# Altium schematic sheet PlatypusDAQ.SchDoc
size C
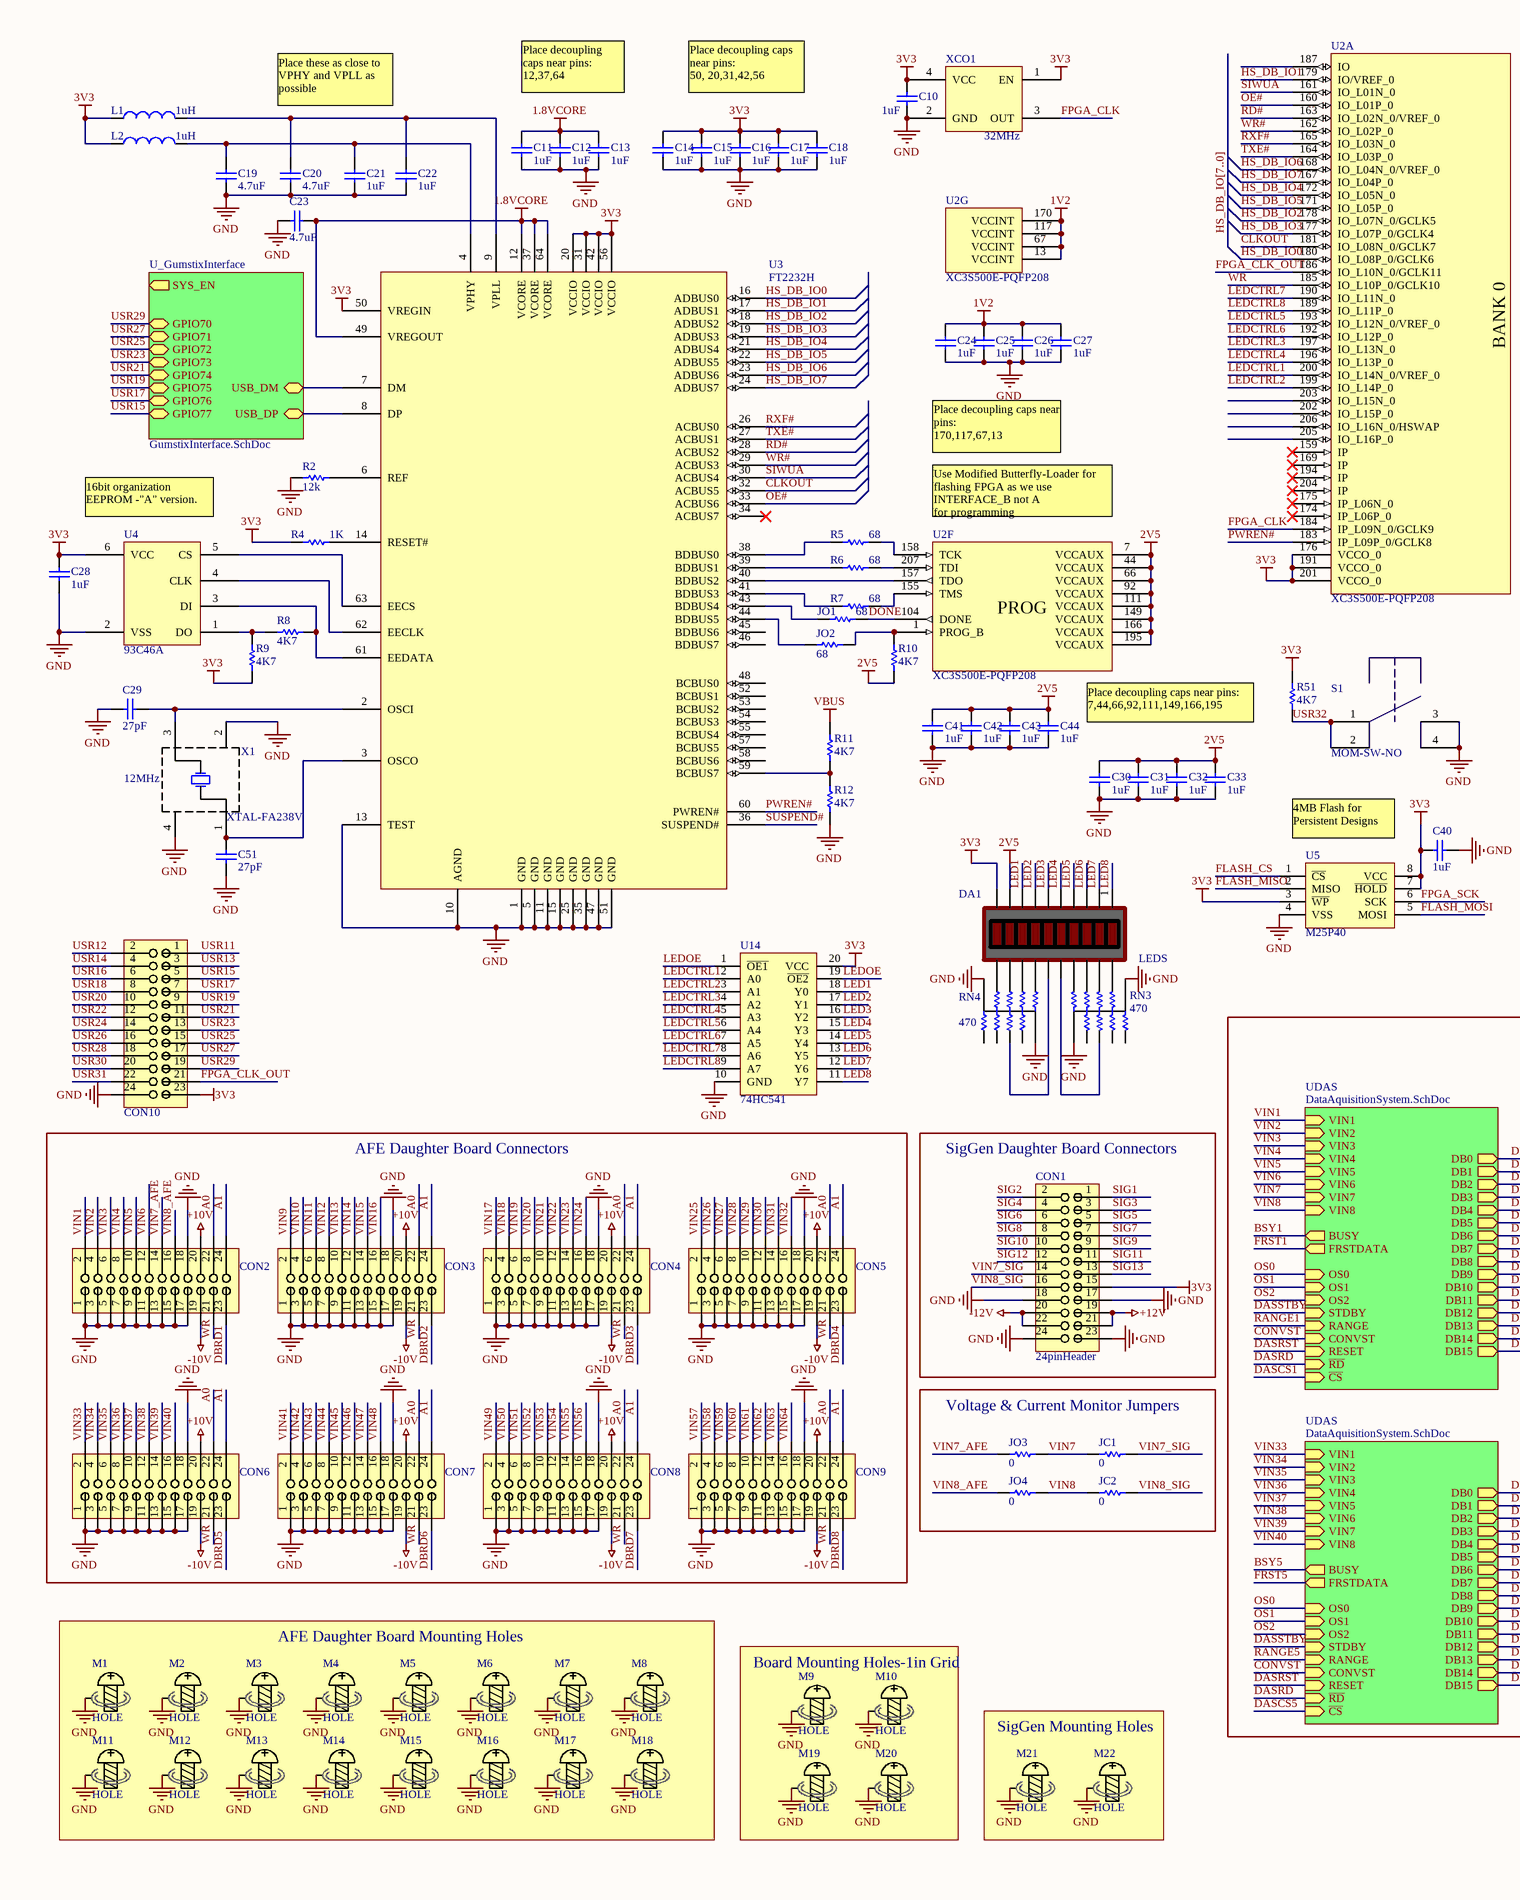
[diagram p0: PlatypusDAQ.SchDoc, left]
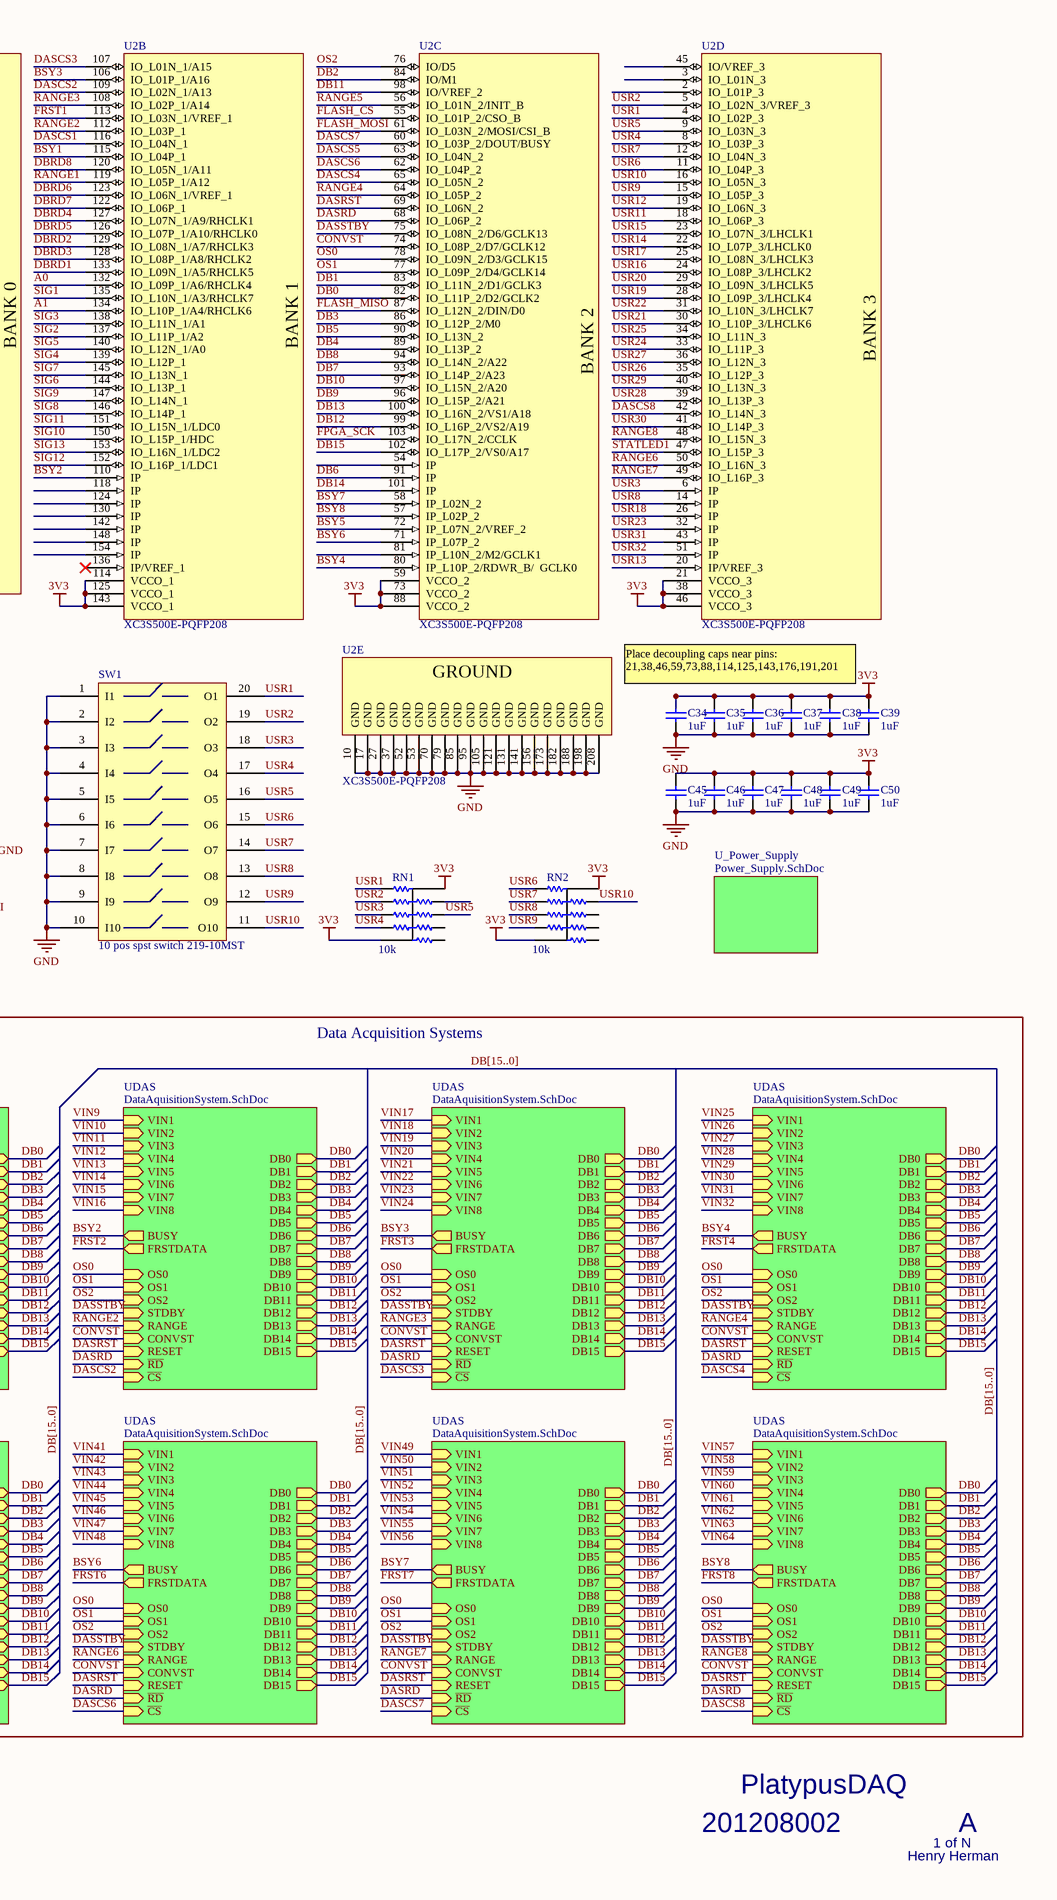
[diagram p1: PlatypusDAQ.SchDoc, right]

## Parts
C10  Label: 1uF  [SM/C_0603]  (hidden comment: CAP)
C11  Label: 1uF  [SM/C_0603]  (hidden comment: CAP)
C12  Label: 1uF  [SM/C_0603]  (hidden comment: CAP)
C13  Label: 1uF  [SM/C_0603]  (hidden comment: CAP)
C14  Label: 1uF  [SM/C_0603]  (hidden comment: CAP)
C15  Label: 1uF  [SM/C_0603]  (hidden comment: CAP)
C16  Label: 1uF  [SM/C_0603]  (hidden comment: CAP)
C17  Label: 1uF  [SM/C_0603]  (hidden comment: CAP)
C18  Label: 1uF  [SM/C_0603]  (hidden comment: CAP)
C19  Label: 4.7uF  [SM/C_0603]  (hidden comment: CAP)
C20  Label: 4.7uF  [SM/C_0603]  (hidden comment: CAP)
C21  Label: 1uF  [SM/C_0603]  (hidden comment: CAP)
C22  Label: 1uF  [SM/C_0603]  (hidden comment: CAP)
C23  Label: 4.7uF  [SM/C_0603]  (hidden comment: CAP)
C24  Label: 1uF  [SM/C_0603]  (hidden comment: CAP)
C25  Label: 1uF  [SM/C_0603]  (hidden comment: CAP)
C26  Label: 1uF  [SM/C_0603]  (hidden comment: CAP)
C27  Label: 1uF  [SM/C_0603]  (hidden comment: CAP)
C28  Label: 1uF  [SM/C_0603]  (hidden comment: CAP)
C29  Label: 27pF  [SM/C_0603]  (hidden comment: CAP)
C30  Label: 1uF  [SM/C_0603]  (hidden comment: CAP)
C31  Label: 1uF  [SM/C_0603]  (hidden comment: CAP)
C32  Label: 1uF  [SM/C_0603]  (hidden comment: CAP)
C33  Label: 1uF  [SM/C_0603]  (hidden comment: CAP)
C34  Label: 1uF  [SM/C_0603]  (hidden comment: CAP)
C35  Label: 1uF  [SM/C_0603]  (hidden comment: CAP)
C36  Label: 1uF  [SM/C_0603]  (hidden comment: CAP)
C37  Label: 1uF  [SM/C_0603]  (hidden comment: CAP)
C38  Label: 1uF  [SM/C_0603]  (hidden comment: CAP)
C39  Label: 1uF  [SM/C_0603]  (hidden comment: CAP)
C40  Label: 1uF  [SM/C_0603]  (hidden comment: CAP)
C41  Label: 1uF  [SM/C_0603]  (hidden comment: CAP)
C42  Label: 1uF  [SM/C_0603]  (hidden comment: CAP)
C43  Label: 1uF  [SM/C_0603]  (hidden comment: CAP)
C44  Label: 1uF  [SM/C_0603]  (hidden comment: CAP)
C45  Label: 1uF  [SM/C_0603]  (hidden comment: CAP)
C46  Label: 1uF  [SM/C_0603]  (hidden comment: CAP)
C47  Label: 1uF  [SM/C_0603]  (hidden comment: CAP)
C48  Label: 1uF  [SM/C_0603]  (hidden comment: CAP)
C49  Label: 1uF  [SM/C_0603]  (hidden comment: CAP)
C50  Label: 1uF  [SM/C_0603]  (hidden comment: CAP)
C51  Label: 27pF  [SM/C_0603]  (hidden comment: CAP)
CON1  24pinHeader  [CONN-RECEPT-24PIN]
CON2  24pinHeader  [CONN-RECEPT-24PIN]  (value not drawn)
CON3  24pinHeader  [CONN-RECEPT-24PIN]  (value not drawn)
CON4  24pinHeader  [CONN-RECEPT-24PIN]  (value not drawn)
CON5  24pinHeader  [CONN-RECEPT-24PIN]  (value not drawn)
CON6  24pinHeader  [CONN-RECEPT-24PIN]  (value not drawn)
CON7  24pinHeader  [CONN-RECEPT-24PIN]  (value not drawn)
CON8  24pinHeader  [CONN-RECEPT-24PIN]  (value not drawn)
CON9  24pinHeader  [CONN-RECEPT-24PIN]  (value not drawn)
CON10  24pinHeader  [CONN-RECEPT-24PIN]  (value not drawn)
DA1  LEDS  [LEDBARGRAPH]
JC1  value 0  [SM/R_0603]  (hidden comment: Res)
JC2  value 0  [SM/R_0603]  (hidden comment: Res)
JO1  value 68  [SM/R_0603]  (hidden comment: Res)
JO2  value 68  [SM/R_0603]  (hidden comment: Res)
JO3  value 0  [SM/R_0603]  (hidden comment: Res)
JO4  value 0  [SM/R_0603]  (hidden comment: Res)
L1  value 1uH  [SM/L_0805]  (hidden comment: Inductor)
L2  value 1uH  [SM/L_0805]  (hidden comment: Inductor)
M1  HOLE  [MOUNTING_HOLE-125mil]
M2  HOLE  [MOUNTING_HOLE-125mil]
M3  HOLE  [MOUNTING_HOLE-125mil]
M4  HOLE  [MOUNTING_HOLE-125mil]
M5  HOLE  [MOUNTING_HOLE-125mil]
M6  HOLE  [MOUNTING_HOLE-125mil]
M7  HOLE  [MOUNTING_HOLE-125mil]
M8  HOLE  [MOUNTING_HOLE-125mil]
M9  HOLE  [MOUNTING_HOLE-125mil]
M10  HOLE  [MOUNTING_HOLE-125mil]
M11  HOLE  [MOUNTING_HOLE-125mil]
M12  HOLE  [MOUNTING_HOLE-125mil]
M13  HOLE  [MOUNTING_HOLE-125mil]
M14  HOLE  [MOUNTING_HOLE-125mil]
M15  HOLE  [MOUNTING_HOLE-125mil]
M16  HOLE  [MOUNTING_HOLE-125mil]
M17  HOLE  [MOUNTING_HOLE-125mil]
M18  HOLE  [MOUNTING_HOLE-125mil]
M19  HOLE  [MOUNTING_HOLE-125mil]
M20  HOLE  [MOUNTING_HOLE-125mil]
M21  HOLE  [MOUNTING_HOLE-125mil]
M22  HOLE  [MOUNTING_HOLE-125mil]
R2  value 12k  [SM/R_0603]  (hidden comment: Res)
R4  value 1K  [SM/R_0603]  (hidden comment: Res)
R5  value 68  [SM/R_0603]  (hidden comment: Res)
R6  value 68  [SM/R_0603]  (hidden comment: Res)
R7  value 68  [SM/R_0603]  (hidden comment: Res)
R8  value 4K7  [SM/R_0603]  (hidden comment: Res)
R9  value 4K7  [SM/R_0603]  (hidden comment: Res)
R10  value 4K7  [SM/R_0603]  (hidden comment: Res)
R11  value 4K7  [SM/R_0603]  (hidden comment: Res)
R12  value 4K7  [SM/R_0603]  (hidden comment: Res)
R51  value 4K7  [SM/R_0603]  (hidden comment: Res)
RN1  value 10k  [RN-5x603]  (hidden comment: RN-8X)
RN2  value 10k  [RN-5x603]  (hidden comment: RN-8X)
RN3  value 470  [RN-5x603]  (hidden comment: RN-8X)
RN4  value 470  [RN-5x603]  (hidden comment: RN-8X)
S1  MOM-SW-NO  [MOM-SW]
SW1  10 pos spst switch 219-10MST  [SW-10pos-SPST]
U2  XC3S500E-PQFP208  [PQFP-208PIN-PQ208-PQG208]  (parts A,B,C,D,E,F,G of 7)
U3  FT2232H  [LQFP-64PIN-FTDI-FT2232H]
U4  93C46A  [SOT23-93C46-EEPROM-Microchip]
U5  M25P40  [SOIC-8pin-micron-M25P40-Flash]
U14  74HC541  [TSSOP-20PIN-74HC541]
X1  XTAL-FA238V  value 12MHz  [XTAL 12MHz SMD]
XCO1  value 32MHz  [CB3&CB3LV-XCO]  (hidden comment: OSC)

## Blocks framed on the sheet
AFE Daughter Board Connectors: CON2-CON9
SigGen Daughter Board Connectors: CON1
Voltage & Current Monitor Jumpers: JC1 JC2 JO3 JO4
AFE Daughter Board Mounting Holes: M1-M8 M11-M18
Board Mounting Holes-1in Grid: M9 M10 M19 M20
SigGen Mounting Holes: M21 M22

## Sub-sheets
U_GumstixInterface = GumstixInterface.SchDoc: SYS_EN (out), USB_DM (bidir), USB_DP (bidir), GPIO70 (bidir), GPIO71 (bidir), GPIO72 (bidir), GPIO73 (bidir), GPIO74 (bidir), GPIO75 (bidir), GPIO76 (bidir), GPIO77 (bidir)
U_Power_Supply = Power_Supply.SchDoc: no entries
UDAS = DataAquisitionSystem.SchDoc: VIN1 (in), VIN2 (in), VIN3 (in), VIN4 (in), VIN5 (in), VIN6 (in), VIN7 (in), VIN8 (in), OS0 (in), OS1 (in), OS2 (in), STDBY (in), RANGE (in), CONVST (in), RESET (in), ~{RD} (in), ~{CS} (in), BUSY (out), FRSTDATA (out), DB0 (out), DB1 (out), DB2 (out), DB3 (out), DB4 (out), DB5 (out), DB6 (out), DB7 (out), DB8 (out), DB9 (out), DB10 (out), DB11 (out), DB12 (out), DB13 (out), DB14 (out), DB15 (out)
UDAS = DataAquisitionSystem.SchDoc: VIN1 (in), VIN2 (in), VIN3 (in), VIN4 (in), VIN5 (in), VIN6 (in), VIN7 (in), VIN8 (in), OS0 (in), OS1 (in), OS2 (in), STDBY (in), RANGE (in), CONVST (in), RESET (in), ~{RD} (in), ~{CS} (in), BUSY (out), FRSTDATA (out), DB0 (out), DB1 (out), DB2 (out), DB3 (out), DB4 (out), DB5 (out), DB6 (out), DB7 (out), DB8 (out), DB9 (out), DB10 (out), DB11 (out), DB12 (out), DB13 (out), DB14 (out), DB15 (out)
UDAS = DataAquisitionSystem.SchDoc: VIN1 (in), VIN2 (in), VIN3 (in), VIN4 (in), VIN5 (in), VIN6 (in), VIN7 (in), VIN8 (in), OS0 (in), OS1 (in), OS2 (in), STDBY (in), RANGE (in), CONVST (in), RESET (in), ~{RD} (in), ~{CS} (in), BUSY (out), FRSTDATA (out), DB0 (out), DB1 (out), DB2 (out), DB3 (out), DB4 (out), DB5 (out), DB6 (out), DB7 (out), DB8 (out), DB9 (out), DB10 (out), DB11 (out), DB12 (out), DB13 (out), DB14 (out), DB15 (out)
UDAS = DataAquisitionSystem.SchDoc: VIN1 (in), VIN2 (in), VIN3 (in), VIN4 (in), VIN5 (in), VIN6 (in), VIN7 (in), VIN8 (in), OS0 (in), OS1 (in), OS2 (in), STDBY (in), RANGE (in), CONVST (in), RESET (in), ~{RD} (in), ~{CS} (in), BUSY (out), FRSTDATA (out), DB0 (out), DB1 (out), DB2 (out), DB3 (out), DB4 (out), DB5 (out), DB6 (out), DB7 (out), DB8 (out), DB9 (out), DB10 (out), DB11 (out), DB12 (out), DB13 (out), DB14 (out), DB15 (out)
UDAS = DataAquisitionSystem.SchDoc: VIN1 (in), VIN2 (in), VIN3 (in), VIN4 (in), VIN5 (in), VIN6 (in), VIN7 (in), VIN8 (in), OS0 (in), OS1 (in), OS2 (in), STDBY (in), RANGE (in), CONVST (in), RESET (in), ~{RD} (in), ~{CS} (in), BUSY (out), FRSTDATA (out), DB0 (out), DB1 (out), DB2 (out), DB3 (out), DB4 (out), DB5 (out), DB6 (out), DB7 (out), DB8 (out), DB9 (out), DB10 (out), DB11 (out), DB12 (out), DB13 (out), DB14 (out), DB15 (out)
UDAS = DataAquisitionSystem.SchDoc: VIN1 (in), VIN2 (in), VIN3 (in), VIN4 (in), VIN5 (in), VIN6 (in), VIN7 (in), VIN8 (in), OS0 (in), OS1 (in), OS2 (in), STDBY (in), RANGE (in), CONVST (in), RESET (in), ~{RD} (in), ~{CS} (in), BUSY (out), FRSTDATA (out), DB0 (out), DB1 (out), DB2 (out), DB3 (out), DB4 (out), DB5 (out), DB6 (out), DB7 (out), DB8 (out), DB9 (out), DB10 (out), DB11 (out), DB12 (out), DB13 (out), DB14 (out), DB15 (out)
UDAS = DataAquisitionSystem.SchDoc: VIN1 (in), VIN2 (in), VIN3 (in), VIN4 (in), VIN5 (in), VIN6 (in), VIN7 (in), VIN8 (in), OS0 (in), OS1 (in), OS2 (in), STDBY (in), RANGE (in), CONVST (in), RESET (in), ~{RD} (in), ~{CS} (in), BUSY (out), FRSTDATA (out), DB0 (out), DB1 (out), DB2 (out), DB3 (out), DB4 (out), DB5 (out), DB6 (out), DB7 (out), DB8 (out), DB9 (out), DB10 (out), DB11 (out), DB12 (out), DB13 (out), DB14 (out), DB15 (out)
UDAS = DataAquisitionSystem.SchDoc: VIN1 (in), VIN2 (in), VIN3 (in), VIN4 (in), VIN5 (in), VIN6 (in), VIN7 (in), VIN8 (in), OS0 (in), OS1 (in), OS2 (in), STDBY (in), RANGE (in), CONVST (in), RESET (in), ~{RD} (in), ~{CS} (in), BUSY (out), FRSTDATA (out), DB0 (out), DB1 (out), DB2 (out), DB3 (out), DB4 (out), DB5 (out), DB6 (out), DB7 (out), DB8 (out), DB9 (out), DB10 (out), DB11 (out), DB12 (out), DB13 (out), DB14 (out), DB15 (out)

## Nets
1.8VCORE: C11.2 C12.2 C13.2 C23.2 U3.12(VCORE) U3.37(VCORE) U3.49(VREGOUT) U3.64(VCORE)
1V2: C24.2 C25.2 C26.2 C27.2 U2.13(VCCINT) U2.67(VCCINT) U2.117(VCCINT) U2.170(VCCINT)
2V5: C30.2 C31.2 C32.2 C33.2 C41.2 C42.2 C43.2 C44.2 DA1.9(A) R10.1 U2.7(VCCAUX) U2.44(VCCAUX) U2.66(VCCAUX) U2.92(VCCAUX) U2.111(VCCAUX) U2.149(VCCAUX) U2.166(VCCAUX) U2.195(VCCAUX)
3V3: C10.2 C14.2 C15.2 C16.2 C17.2 C18.2 C28.2 C34.2 C35.2 C36.2 C37.2 C38.2 C39.2 C40.2 C45.2 C46.2 C47.2 C48.2 C49.2 C50.2 CON1.15 CON10.23 DA1.10(A) L1.1 L2.1 R4.1 R9.1 R51.1 RN1.COM RN2.COM U2.21(VCCO_3) U2.38(VCCO_3) U2.46(VCCO_3) U2.59(VCCO_2) U2.73(VCCO_2) U2.88(VCCO_2) U2.114(VCCO_1) U2.125(VCCO_1) U2.143(VCCO_1) U2.176(VCCO_0) U2.191(VCCO_0) U2.201(VCCO_0) U3.20(VCCIO) U3.31(VCCIO) U3.42(VCCIO) U3.50(VREGIN) U3.56(VCCIO) U4.6(VCC) U5.3(~{WP}) U5.7(~{HOLD}) U5.8(VCC) U14.20(VCC) XCO1.1(EN) XCO1.4(VCC)
+10V: CON2.20 CON3.20 CON4.20 CON5.20 CON6.20 CON7.20 CON8.20 CON9.20
+12V: CON1.19 CON1.21
-10V: CON2.19 CON3.19 CON4.19 CON5.19 CON6.19 CON7.19 CON8.19 CON9.19
-12V: CON1.20 CON1.22
GND: C10.1 C11.1 C12.1 C13.1 C14.1 C15.1 C16.1 C17.1 C18.1 C19.1 C20.1 C21.1 C22.1 C23.1 C24.1 C25.1 C26.1 C27.1 C28.1 C29.2 C30.1 C31.1 C32.1 C33.1 C34.1 C35.1 C36.1 C37.1 C38.1 C39.1 C40.1 C41.1 C42.1 C43.1 C44.1 C45.1 C46.1 C47.1 C48.1 C49.1 C50.1 C51.1 CON1.17 CON1.18 CON1.23 CON1.24 CON2.1 CON2.3 CON2.5 CON2.7 CON2.9 CON2.11 CON2.13 CON2.15 CON2.17 CON2.18 CON3.1 CON3.3 CON3.5 CON3.7 CON3.9 CON3.11 CON3.13 CON3.15 CON3.17 CON3.18 CON4.1 CON4.3 CON4.5 CON4.7 CON4.9 CON4.11 CON4.13 CON4.15 CON4.17 CON4.18 CON5.1 CON5.3 CON5.5 CON5.7 CON5.9 CON5.11 CON5.13 CON5.15 CON5.17 CON5.18 CON6.1 CON6.3 CON6.5 CON6.7 CON6.9 CON6.11 CON6.13 CON6.15 CON6.17 CON6.18 CON7.1 CON7.3 CON7.5 CON7.7 CON7.9 CON7.11 CON7.13 CON7.15 CON7.17 CON7.18 CON8.1 CON8.3 CON8.5 CON8.7 CON8.9 CON8.11 CON8.13 CON8.15 CON8.17 CON8.18 CON9.1 CON9.3 CON9.5 CON9.7 CON9.9 CON9.11 CON9.13 CON9.15 CON9.17 CON9.18 CON10.24 M1.0(PAD) M2.0(PAD) M3.0(PAD) M4.0(PAD) M5.0(PAD) M6.0(PAD) M7.0(PAD) M8.0(PAD) M9.0(PAD) M10.0(PAD) M11.0(PAD) M12.0(PAD) M13.0(PAD) M14.0(PAD) M15.0(PAD) M16.0(PAD) M17.0(PAD) M18.0(PAD) M19.0(PAD) M20.0(PAD) M21.0(PAD) M22.0(PAD) R2.2 R12.2 RN3.COM RN4.COM S1.3 S1.4 SW1.1(I1) SW1.2(I2) SW1.3(I3) SW1.4(I4) SW1.5(I5) SW1.6(I6) SW1.7(I7) SW1.8(I8) SW1.9(I9) SW1.10(I10) U2.10(GND) U2.17(GND) U2.27(GND) U2.37(GND) U2.52(GND) U2.53(GND) U2.70(GND) U2.79(GND) U2.85(GND) U2.95(GND) U2.105(GND) U2.121(GND) U2.131(GND) U2.141(GND) U2.156(GND) U2.173(GND) U2.182(GND) U2.188(GND) U2.198(GND) U2.208(GND) U3.1(GND) U3.5(GND) U3.10(AGND) U3.11(GND) U3.13(TEST) U3.15(GND) U3.25(GND) U3.35(GND) U3.47(GND) U3.51(GND) U4.2(VSS) U5.4(VSS) U14.10(GND) X1.2 X1.4 XCO1.2(GND)
VBUS: R11.1
A0: CON2.22 CON3.22 CON4.22 CON5.22 CON6.22 CON7.22 CON8.22 CON9.22 U2.132(IO_L09P_1/A6/RHCLK4)
A1: CON2.24 CON3.24 CON4.24 CON5.24 CON6.24 CON7.24 CON8.24 CON9.24 U2.134(IO_L10P_1/A4/RHCLK6)
BSY1: U2.115(IO_L04P_1) ; sheet UDAS/BUSY
BSY2: U2.110(IP) ; sheet UDAS/BUSY
BSY3: U2.106(IO_L01P_1/A16) ; sheet UDAS/BUSY
BSY4: U2.80(IP_L10P_2/RDWR_B/__GCLK0) ; sheet UDAS/BUSY
BSY5: U2.72(IP_L07N_2/VREF_2) ; sheet UDAS/BUSY
BSY6: U2.71(IP_L07P_2) ; sheet UDAS/BUSY
BSY7: U2.58(IP_L02N_2) ; sheet UDAS/BUSY
BSY8: U2.57(IP_L02P_2) ; sheet UDAS/BUSY
CLKOUT: U2.181(IO_L08N_0/GCLK7) U3.32(ACBUS5)
CONVST: U2.74(IO_L08P_2/D7/GCLK12) ; sheet UDAS/CONVST, sheet UDAS/CONVST, sheet UDAS/CONVST, sheet UDAS/CONVST, sheet UDAS/CONVST, sheet UDAS/CONVST, sheet UDAS/CONVST, sheet UDAS/CONVST
DASCS1: U2.116(IO_L04N_1) ; sheet UDAS/~{CS}
DASCS2: U2.109(IO_L02N_1/A13) ; sheet UDAS/~{CS}
DASCS3: U2.107(IO_L01N_1/A15) ; sheet UDAS/~{CS}
DASCS4: U2.65(IO_L05N_2) ; sheet UDAS/~{CS}
DASCS5: U2.63(IO_L04N_2) ; sheet UDAS/~{CS}
DASCS6: U2.62(IO_L04P_2) ; sheet UDAS/~{CS}
DASCS7: U2.60(IO_L03P_2/DOUT/BUSY) ; sheet UDAS/~{CS}
DASCS8: U2.42(IO_L14N_3) ; sheet UDAS/~{CS}
DASRD: U2.68(IO_L06P_2) ; sheet UDAS/~{RD}, sheet UDAS/~{RD}, sheet UDAS/~{RD}, sheet UDAS/~{RD}, sheet UDAS/~{RD}, sheet UDAS/~{RD}, sheet UDAS/~{RD}, sheet UDAS/~{RD}
DASRST: U2.69(IO_L06N_2) ; sheet UDAS/RESET, sheet UDAS/RESET, sheet UDAS/RESET, sheet UDAS/RESET, sheet UDAS/RESET, sheet UDAS/RESET, sheet UDAS/RESET, sheet UDAS/RESET
DASSTBY: U2.75(IO_L08N_2/D6/GCLK13) ; sheet UDAS/STDBY, sheet UDAS/STDBY, sheet UDAS/STDBY, sheet UDAS/STDBY, sheet UDAS/STDBY, sheet UDAS/STDBY, sheet UDAS/STDBY, sheet UDAS/STDBY
DB0: U2.82(IO_L11P_2/D2/GCLK2) ; sheet UDAS/DB0, sheet UDAS/DB0, sheet UDAS/DB0, sheet UDAS/DB0, sheet UDAS/DB0, sheet UDAS/DB0, sheet UDAS/DB0, sheet UDAS/DB0
DB1: U2.83(IO_L11N_2/D1/GCLK3) ; sheet UDAS/DB1, sheet UDAS/DB1, sheet UDAS/DB1, sheet UDAS/DB1, sheet UDAS/DB1, sheet UDAS/DB1, sheet UDAS/DB1, sheet UDAS/DB1
DB2: U2.84(IO/M1) ; sheet UDAS/DB2, sheet UDAS/DB2, sheet UDAS/DB2, sheet UDAS/DB2, sheet UDAS/DB2, sheet UDAS/DB2, sheet UDAS/DB2, sheet UDAS/DB2
DB3: U2.86(IO_L12P_2/M0) ; sheet UDAS/DB3, sheet UDAS/DB3, sheet UDAS/DB3, sheet UDAS/DB3, sheet UDAS/DB3, sheet UDAS/DB3, sheet UDAS/DB3, sheet UDAS/DB3
DB4: U2.89(IO_L13P_2) ; sheet UDAS/DB4, sheet UDAS/DB4, sheet UDAS/DB4, sheet UDAS/DB4, sheet UDAS/DB4, sheet UDAS/DB4, sheet UDAS/DB4, sheet UDAS/DB4
DB5: U2.90(IO_L13N_2) ; sheet UDAS/DB5, sheet UDAS/DB5, sheet UDAS/DB5, sheet UDAS/DB5, sheet UDAS/DB5, sheet UDAS/DB5, sheet UDAS/DB5, sheet UDAS/DB5
DB6: U2.91(IP) ; sheet UDAS/DB6, sheet UDAS/DB6, sheet UDAS/DB6, sheet UDAS/DB6, sheet UDAS/DB6, sheet UDAS/DB6, sheet UDAS/DB6, sheet UDAS/DB6
DB7: U2.93(IO_L14P_2/A23) ; sheet UDAS/DB7, sheet UDAS/DB7, sheet UDAS/DB7, sheet UDAS/DB7, sheet UDAS/DB7, sheet UDAS/DB7, sheet UDAS/DB7, sheet UDAS/DB7
DB8: U2.94(IO_L14N_2/A22) ; sheet UDAS/DB8, sheet UDAS/DB8, sheet UDAS/DB8, sheet UDAS/DB8, sheet UDAS/DB8, sheet UDAS/DB8, sheet UDAS/DB8, sheet UDAS/DB8
DB9: U2.96(IO_L15P_2/A21) ; sheet UDAS/DB9, sheet UDAS/DB9, sheet UDAS/DB9, sheet UDAS/DB9, sheet UDAS/DB9, sheet UDAS/DB9, sheet UDAS/DB9, sheet UDAS/DB9
DB10: U2.97(IO_L15N_2/A20) ; sheet UDAS/DB10, sheet UDAS/DB10, sheet UDAS/DB10, sheet UDAS/DB10, sheet UDAS/DB10, sheet UDAS/DB10, sheet UDAS/DB10, sheet UDAS/DB10
DB11: U2.98(IO/VREF_2) ; sheet UDAS/DB11, sheet UDAS/DB11, sheet UDAS/DB11, sheet UDAS/DB11, sheet UDAS/DB11, sheet UDAS/DB11, sheet UDAS/DB11, sheet UDAS/DB11
DB12: U2.99(IO_L16P_2/VS2/A19) ; sheet UDAS/DB12, sheet UDAS/DB12, sheet UDAS/DB12, sheet UDAS/DB12, sheet UDAS/DB12, sheet UDAS/DB12, sheet UDAS/DB12, sheet UDAS/DB12
DB13: U2.100(IO_L16N_2/VS1/A18) ; sheet UDAS/DB13, sheet UDAS/DB13, sheet UDAS/DB13, sheet UDAS/DB13, sheet UDAS/DB13, sheet UDAS/DB13, sheet UDAS/DB13, sheet UDAS/DB13
DB14: U2.101(IP) ; sheet UDAS/DB14, sheet UDAS/DB14, sheet UDAS/DB14, sheet UDAS/DB14, sheet UDAS/DB14, sheet UDAS/DB14, sheet UDAS/DB14, sheet UDAS/DB14
DB15: U2.102(IO_L17P_2/VS0/A17) ; sheet UDAS/DB15, sheet UDAS/DB15, sheet UDAS/DB15, sheet UDAS/DB15, sheet UDAS/DB15, sheet UDAS/DB15, sheet UDAS/DB15, sheet UDAS/DB15
DBRD1: CON2.23 U2.133(IO_L09N_1/A5/RHCLK5)
DBRD2: CON3.23 U2.129(IO_L08N_1/A7/RHCLK3)
DBRD3: CON4.23 U2.128(IO_L08P_1/A8/RHCLK2)
DBRD4: CON5.23 U2.127(IO_L07N_1/A9/RHCLK1)
DBRD5: CON6.23 U2.126(IO_L07P_1/A10/RHCLK0)
DBRD6: CON7.23 U2.123(IO_L06N_1/VREF_1)
DBRD7: CON8.23 U2.122(IO_L06P_1)
DBRD8: CON9.23 U2.120(IO_L05N_1/A11)
DONE: JO1.2 U2.104(DONE)
FLASH_CS: U2.55(IO_L01P_2/CSO_B) U5.1(~{CS})
FLASH_MISO: U2.87(IO_L12N_2/DIN/D0) U5.2(MISO)
FLASH_MOSI: U2.61(IO_L03N_2/MOSI/CSI_B) U5.5(MOSI)
FPGA_CLK: U2.184(IP_L09N_0/GCLK9) XCO1.3(OUT)
FPGA_CLK_OUT: CON10.21 U2.186(IO_L10N_0/GCLK11)
FPGA_SCK: U2.103(IO_L17N_2/CCLK) U5.6(SCK)
FRST1: U2.113(IO_L03N_1/VREF_1) ; sheet UDAS/FRSTDATA
FRST2: sheet UDAS/FRSTDATA
FRST3: sheet UDAS/FRSTDATA
FRST4: sheet UDAS/FRSTDATA
FRST5: sheet UDAS/FRSTDATA
FRST6: sheet UDAS/FRSTDATA
FRST7: sheet UDAS/FRSTDATA
FRST8: sheet UDAS/FRSTDATA
HS_DB_IO0: U2.180(IO_L08P_0/GCLK6) U3.16(ADBUS0)
HS_DB_IO1: U2.179(IO/VREF_0) U3.17(ADBUS1)
HS_DB_IO2: U2.178(IO_L07N_0/GCLK5) U3.18(ADBUS2)
HS_DB_IO3: U2.177(IO_L07P_0/GCLK4) U3.19(ADBUS3)
HS_DB_IO4: U2.172(IO_L05N_0) U3.21(ADBUS4)
HS_DB_IO5: U2.171(IO_L05P_0) U3.22(ADBUS5)
HS_DB_IO6: U2.168(IO_L04N_0/VREF_0) U3.23(ADBUS6)
HS_DB_IO7: U2.167(IO_L04P_0) U3.24(ADBUS7)
LED1: DA1.8(A) U14.18(Y0)
LED2: DA1.7(A) U14.17(Y1)
LED3: DA1.6(A) U14.16(Y2)
LED4: DA1.5(A) U14.15(Y3)
LED5: DA1.4(A) U14.14(Y4)
LED6: DA1.3(A) U14.13(Y5)
LED7: DA1.2(A) U14.12(Y6)
LED8: DA1.1(A) U14.11(Y7)
LEDCTRL1: U2.200(IO_L14N_0/VREF_0) U14.2(A0)
LEDCTRL2: U2.199(IO_L14P_0) U14.3(A1)
LEDCTRL3: U2.197(IO_L13N_0) U14.4(A2)
LEDCTRL4: U2.196(IO_L13P_0) U14.5(A3)
LEDCTRL5: U2.193(IO_L12N_0/VREF_0) U14.6(A4)
LEDCTRL6: U2.192(IO_L12P_0) U14.7(A5)
LEDCTRL7: U2.190(IO_L11N_0) U14.8(A6)
LEDCTRL8: U2.189(IO_L11P_0) U14.9(A7)
LEDOE: U14.1(~{OE1}) U14.19(~{OE2})
OE#: U2.160(IO_L01P_0) U3.33(ACBUS6)
OS0: U2.78(IO_L09N_2/D3/GCLK15) ; sheet UDAS/OS0, sheet UDAS/OS0, sheet UDAS/OS0, sheet UDAS/OS0, sheet UDAS/OS0, sheet UDAS/OS0, sheet UDAS/OS0, sheet UDAS/OS0
OS1: U2.77(IO_L09P_2/D4/GCLK14) ; sheet UDAS/OS1, sheet UDAS/OS1, sheet UDAS/OS1, sheet UDAS/OS1, sheet UDAS/OS1, sheet UDAS/OS1, sheet UDAS/OS1, sheet UDAS/OS1
OS2: U2.76(IO/D5) ; sheet UDAS/OS2, sheet UDAS/OS2, sheet UDAS/OS2, sheet UDAS/OS2, sheet UDAS/OS2, sheet UDAS/OS2, sheet UDAS/OS2, sheet UDAS/OS2
PWREN#: U2.183(IP_L09P_0/GCLK8) U3.60(PWREN#)
RANGE1: U2.119(IO_L05P_1/A12) ; sheet UDAS/RANGE
RANGE2: U2.112(IO_L03P_1) ; sheet UDAS/RANGE
RANGE3: U2.108(IO_L02P_1/A14) ; sheet UDAS/RANGE
RANGE4: U2.64(IO_L05P_2) ; sheet UDAS/RANGE
RANGE5: U2.56(IO_L01N_2/INIT_B) ; sheet UDAS/RANGE
RANGE6: U2.50(IO_L16N_3) ; sheet UDAS/RANGE
RANGE7: U2.49(IO_L16P_3) ; sheet UDAS/RANGE
RANGE8: U2.48(IO_L15N_3) ; sheet UDAS/RANGE
RD#: U2.163(IO_L02N_0/VREF_0) U3.28(ACBUS2)
RXF#: U2.165(IO_L03N_0) U3.26(ACBUS0)
SIG1: CON1.1 U2.135(IO_L10N_1/A3/RHCLK7)
SIG2: CON1.2 U2.137(IO_L11P_1/A2)
SIG3: CON1.3 U2.138(IO_L11N_1/A1)
SIG4: CON1.4 U2.139(IO_L12P_1)
SIG5: CON1.5 U2.140(IO_L12N_1/A0)
SIG6: CON1.6 U2.144(IO_L13P_1)
SIG7: CON1.7 U2.145(IO_L13N_1)
SIG8: CON1.8 U2.146(IO_L14P_1)
SIG9: CON1.9 U2.147(IO_L14N_1)
SIG10: CON1.10 U2.150(IO_L15P_1/HDC)
SIG11: CON1.11 U2.151(IO_L15N_1/LDC0)
SIG12: CON1.12 U2.152(IO_L16P_1/LDC1)
SIG13: CON1.13 U2.153(IO_L16N_1/LDC2)
SIWUA: U2.161(IO_L01N_0) U3.30(ACBUS4)
STATLED1: U2.47(IO_L15P_3)
SUSPEND#: U3.36(SUSPEND#)
TXE#: U2.164(IO_L03P_0) U3.27(ACBUS1)
USR1: RN1.4 SW1.20(O1) U2.4(IO_L02P_3)
USR2: RN1.3 SW1.19(O2) U2.5(IO_L02N_3/VREF_3)
USR3: RN1.2 SW1.18(O3) U2.6(IP)
USR4: RN1.1 SW1.17(O4) U2.8(IO_L03P_3)
USR5: RN1.7 SW1.16(O5) U2.9(IO_L03N_3)
USR6: RN2.4 SW1.15(O6) U2.11(IO_L04P_3)
USR7: RN2.3 SW1.14(O7) U2.12(IO_L04N_3)
USR8: RN2.2 SW1.13(O8) U2.14(IP)
USR9: RN2.1 SW1.12(O9) U2.15(IO_L05P_3)
USR10: RN2.8 SW1.11(O10) U2.16(IO_L05N_3)
USR11: CON10.1 U2.18(IO_L06P_3)
USR12: CON10.2 U2.19(IO_L06N_3)
USR13: CON10.3 U2.20(IP/VREF_3)
USR14: CON10.4 U2.22(IO_L07P_3/LHCLK0)
USR15: CON10.5 U2.23(IO_L07N_3/LHCLK1) ; sheet U_GumstixInterface/GPIO77
USR16: CON10.6 U2.24(IO_L08P_3/LHCLK2)
USR17: CON10.7 U2.25(IO_L08N_3/LHCLK3) ; sheet U_GumstixInterface/GPIO76
USR18: CON10.8 U2.26(IP)
USR19: CON10.9 U2.28(IO_L09P_3/LHCLK4) ; sheet U_GumstixInterface/GPIO75
USR20: CON10.10 U2.29(IO_L09N_3/LHCLK5)
USR21: CON10.11 U2.30(IO_L10P_3/LHCLK6) ; sheet U_GumstixInterface/GPIO74
USR22: CON10.12 U2.31(IO_L10N_3/LHCLK7)
USR23: CON10.13 U2.32(IP) ; sheet U_GumstixInterface/GPIO73
USR24: CON10.14 U2.33(IO_L11P_3)
USR25: CON10.15 U2.34(IO_L11N_3) ; sheet U_GumstixInterface/GPIO72
USR26: CON10.16 U2.35(IO_L12P_3)
USR27: CON10.17 U2.36(IO_L12N_3) ; sheet U_GumstixInterface/GPIO71
USR28: CON10.18 U2.39(IO_L13P_3)
USR29: CON10.19 U2.40(IO_L13N_3) ; sheet U_GumstixInterface/GPIO70
USR30: CON10.20 U2.41(IO_L14P_3)
USR31: CON10.22 U2.43(IP)
USR32: R51.2 S1.1 S1.2 U2.51(IP)
VIN1: CON2.2 ; sheet UDAS/VIN1
VIN2: CON2.4 ; sheet UDAS/VIN2
VIN3: CON2.6 ; sheet UDAS/VIN3
VIN4: CON2.8 ; sheet UDAS/VIN4
VIN5: CON2.10 ; sheet UDAS/VIN5
VIN6: CON2.12 ; sheet UDAS/VIN6
VIN7: JC1.2 JO3.2 ; sheet UDAS/VIN7
VIN7_AFE: CON2.14 JO3.1
VIN7_SIG: CON1.14 JC1.1
VIN8: JC2.1 JO4.2 ; sheet UDAS/VIN8
VIN8_AFE: CON2.16 JO4.1
VIN8_SIG: CON1.16 JC2.2
VIN9: CON3.2 ; sheet UDAS/VIN1
VIN10: CON3.4 ; sheet UDAS/VIN2
VIN11: CON3.6 ; sheet UDAS/VIN3
VIN12: CON3.8 ; sheet UDAS/VIN4
VIN13: CON3.10 ; sheet UDAS/VIN5
VIN14: CON3.12 ; sheet UDAS/VIN6
VIN15: CON3.14 ; sheet UDAS/VIN7
VIN16: CON3.16 ; sheet UDAS/VIN8
VIN17: CON4.2 ; sheet UDAS/VIN1
VIN18: CON4.4 ; sheet UDAS/VIN2
VIN19: CON4.6 ; sheet UDAS/VIN3
VIN20: CON4.8 ; sheet UDAS/VIN4
VIN21: CON4.10 ; sheet UDAS/VIN5
VIN22: CON4.12 ; sheet UDAS/VIN6
VIN23: CON4.14 ; sheet UDAS/VIN7
VIN24: CON4.16 ; sheet UDAS/VIN8
VIN25: CON5.2 ; sheet UDAS/VIN1
VIN26: CON5.4 ; sheet UDAS/VIN2
VIN27: CON5.6 ; sheet UDAS/VIN3
VIN28: CON5.8 ; sheet UDAS/VIN4
VIN29: CON5.10 ; sheet UDAS/VIN5
VIN30: CON5.12 ; sheet UDAS/VIN6
VIN31: CON5.14 ; sheet UDAS/VIN7
VIN32: CON5.16 ; sheet UDAS/VIN8
VIN33: CON6.2 ; sheet UDAS/VIN1
VIN34: CON6.4 ; sheet UDAS/VIN2
VIN35: CON6.6 ; sheet UDAS/VIN3
VIN36: CON6.8 ; sheet UDAS/VIN4
VIN37: CON6.10 ; sheet UDAS/VIN5
VIN38: CON6.12 ; sheet UDAS/VIN6
VIN39: CON6.14 ; sheet UDAS/VIN7
VIN40: CON6.16 ; sheet UDAS/VIN8
VIN41: CON7.2 ; sheet UDAS/VIN1
VIN42: CON7.4 ; sheet UDAS/VIN2
VIN43: CON7.6 ; sheet UDAS/VIN3
VIN44: CON7.8 ; sheet UDAS/VIN4
VIN45: CON7.10 ; sheet UDAS/VIN5
VIN46: CON7.12 ; sheet UDAS/VIN6
VIN47: CON7.14 ; sheet UDAS/VIN7
VIN48: CON7.16 ; sheet UDAS/VIN8
VIN49: CON8.2 ; sheet UDAS/VIN1
VIN50: CON8.4 ; sheet UDAS/VIN2
VIN51: CON8.6 ; sheet UDAS/VIN3
VIN52: CON8.8 ; sheet UDAS/VIN4
VIN53: CON8.10 ; sheet UDAS/VIN5
VIN54: CON8.12 ; sheet UDAS/VIN6
VIN55: CON8.14 ; sheet UDAS/VIN7
VIN56: CON8.16 ; sheet UDAS/VIN8
VIN57: CON9.2 ; sheet UDAS/VIN1
VIN58: CON9.4 ; sheet UDAS/VIN2
VIN59: CON9.6 ; sheet UDAS/VIN3
VIN60: CON9.8 ; sheet UDAS/VIN4
VIN61: CON9.10 ; sheet UDAS/VIN5
VIN62: CON9.12 ; sheet UDAS/VIN6
VIN63: CON9.14 ; sheet UDAS/VIN7
VIN64: CON9.16 ; sheet UDAS/VIN8
WR: CON2.21 CON3.21 CON4.21 CON5.21 CON6.21 CON7.21 CON8.21 CON9.21 U2.185(IO_L10P_0/GCLK10)
WR#: U2.162(IO_L02P_0) U3.29(ACBUS3)
NetC19_2: C19.2 C21.2 L2.2 U3.4(VPHY)
NetC20_2: C20.2 C22.2 L1.2 U3.9(VPLL)
NetC29_1: C29.1 U3.2(OSCI) X1.3
NetC51_2: C51.2 U3.3(OSCO) X1.1
NetDA1_11: DA1.11(C) RN4.8
NetDA1_12: DA1.12(C) RN4.7
NetDA1_13: DA1.13(C) RN4.6
NetDA1_14: DA1.14(C) RN4.5
NetDA1_15: DA1.15(C) RN4.2
NetDA1_16: DA1.16(C) RN3.7
NetDA1_17: DA1.17(C) RN3.4
NetDA1_18: DA1.18(C) RN3.3
NetDA1_19: DA1.19(C) RN3.2
NetDA1_20: DA1.20(C) RN3.1
NetJO1_1: JO1.1 U3.43(BDBUS4)
NetJO2_1: JO2.1 U3.44(BDBUS5)
NetJO2_2: JO2.2 R10.2 U2.1(PROG_B)
NetR2_1: R2.1 U3.6(REF)
NetR4_2: R4.2 U3.14(RESET#)
NetR5_1: R5.1 U3.38(BDBUS0)
NetR5_2: R5.2 U2.158(TCK)
NetR6_1: R6.1 U3.39(BDBUS1)
NetR6_2: R6.2 U2.207(TDI)
NetR7_1: R7.1 U3.41(BDBUS3)
NetR7_2: R7.2 U2.155(TMS)
NetR8_1: R8.1 U3.61(EEDATA) U4.3(DI)
NetR8_2: R8.2 R9.2 U4.1(DO)
NetR11_2: R11.2 R12.1 U3.59(BCBUS7)
NetU2_157: U2.157(TDO) U3.40(BDBUS2)
NetU3_7: U3.7(DM) ; sheet U_GumstixInterface/USB_DM
NetU3_8: U3.8(DP) ; sheet U_GumstixInterface/USB_DP
NetU3_62: U3.62(EECLK) U4.4(CLK)
NetU3_63: U3.63(EECS) U4.5(CS)

Not connected (* = marked no-connect by the designer): RN1 5 6 8; RN2 5 6 7; RN3 5 6 8; RN4 1 3 4; U2 2(IO_L01P_3) 3(IO_L01N_3) 45(IO/VREF_3) 54(IP) 81(IP_L10N_2/M2/GCLK1) 118(IP) 124(IP) 130(IP) 136(IP/VREF_1)* 142(IP) 148(IP) 154(IP) 159(IP)* 169(IP)* 174(IP_L06P_0)* 175(IP_L06N_0)* 187(IO) 194(IP)* 202(IO_L15P_0) 203(IO_L15N_0) 204(IP)* 205(IO_L16P_0) 206(IO_L16N_0/HSWAP); U3 34(ACBUS7)* 45(BDBUS6) 46(BDBUS7) 48(BCBUS0) 52(BCBUS1) 53(BCBUS2) 54(BCBUS3) 55(BCBUS4) 57(BCBUS5) 58(BCBUS6)

## Buses and harness runs
bus DB[15..0]
bus HS_DB_IO[7..0]

## Notes on the sheet
- Place these as close to VPHY and VPLL as possible
- Place decoupling caps near pins:
  12,37,64
- Place decoupling caps near pins:
  50, 20,31,42,56
- Place decoupling caps near pins:
  170,117,67,13
- 16bit organization EEPROM -"A" version.
- (near U2) Use Modified Butterfly-Loader for flashing FPGA as we use INTERFACE_B not A
  for programming
- Place decoupling caps near pins:
  21,38,46,59,73,88,114,125,143,176,191,201
- Place decoupling caps near pins:
  7,44,66,92,111,149,166,195
- 4MB Flash for
  Persistent Designs
- Data Acquisition Systems
- PlatypusDAQ
- 201208002
- Henry Herman
- 1 of N
- A
- (in symbol XC3S500E-PQ208, part A) BANK 0
- (in symbol XC3S500E-PQ208, part B) BANK 1
- (in symbol XC3S500E-PQ208, part C) BANK 2
- (in symbol XC3S500E-PQ208, part D) BANK 3
- (in symbol XC3S500E-PQ208, part E) GROUND
- (in symbol XC3S500E-PQ208, part F) PROG

## Library data of the parts
C10-C18 C21 C22 C24-C28 C30-C50 = CAP: Value: 1uF
C19 C20 C23 = CAP: Value: 4.7uF
C29 C51 = CAP: Value: 27pF
DA1 = LEDBARGRAPH
JC1 JC2 JO1-JO4 R2 R4-R12 R51 = Res: Resistor; Published: 8-Jun-2000; LatestRevisionDate: 17-Jul-2002; LatestRevisionNote: Re-released for DXP Platform.; PackageReference: AXIAL-0.3; Publisher: Altium Limited
M1-M22 = MountingHole
RN1-RN4 = RN-8X: MNR15E0RPJ103
S1 = MOM-BUT
U2 = XC3S500E-PQ208
U4 = 93CX6-EEPROM
U5 = M25P40-Flash
U14 = 74HC541(Non-inverting buffer)
XCO1 = XCO